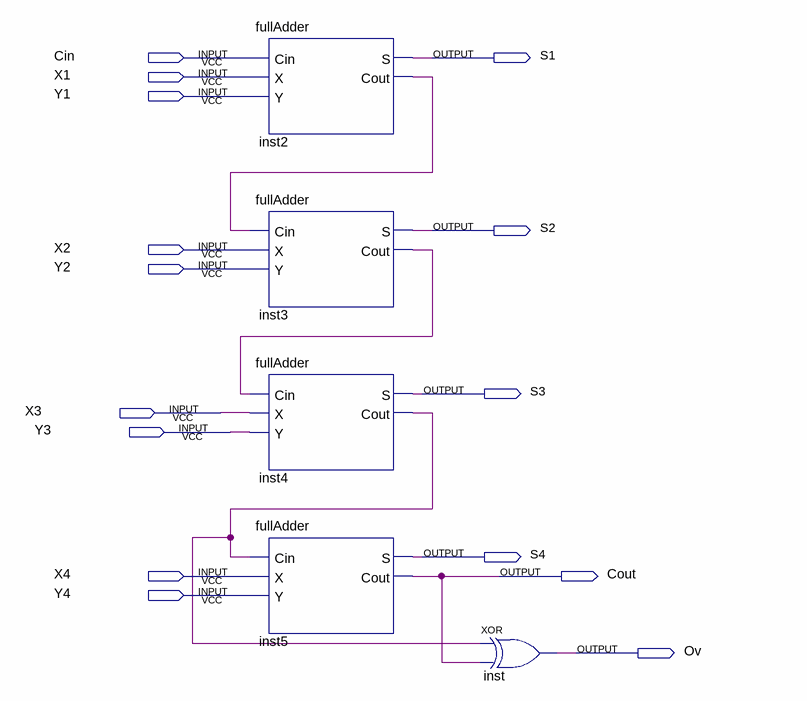
[diagram p0: schematic sheet]
// Quartus schematic adder4bt.bdf as structural Verilog: 5 symbols, 15 pins
module adder4bt (
  input  Cin,
  input  X1,
  input  Y1,
  input  X2,
  input  Y2,
  input  X3,
  input  Y3,
  input  X4,
  input  Y4,
  output S1,
  output S2,
  output S3,
  output S4,
  output Cout,
  output Ov
);

  wire inst2_cout, inst3_cout, inst4_cout;

  fullAdder inst2 (.Cin(Cin), .X(X1), .Y(Y1), .S(S1), .Cout(inst2_cout));
  fullAdder inst3 (.Cin(inst2_cout), .X(X2), .Y(Y2), .S(S2), .Cout(inst3_cout));
  fullAdder inst4 (.Cin(inst3_cout), .X(X3), .Y(Y3), .S(S3), .Cout(inst4_cout));
  fullAdder inst5 (.Cin(inst4_cout), .X(X4), .Y(Y4), .S(S4), .Cout(Cout));
  xor inst (Ov, inst4_cout, Cout);
endmodule
